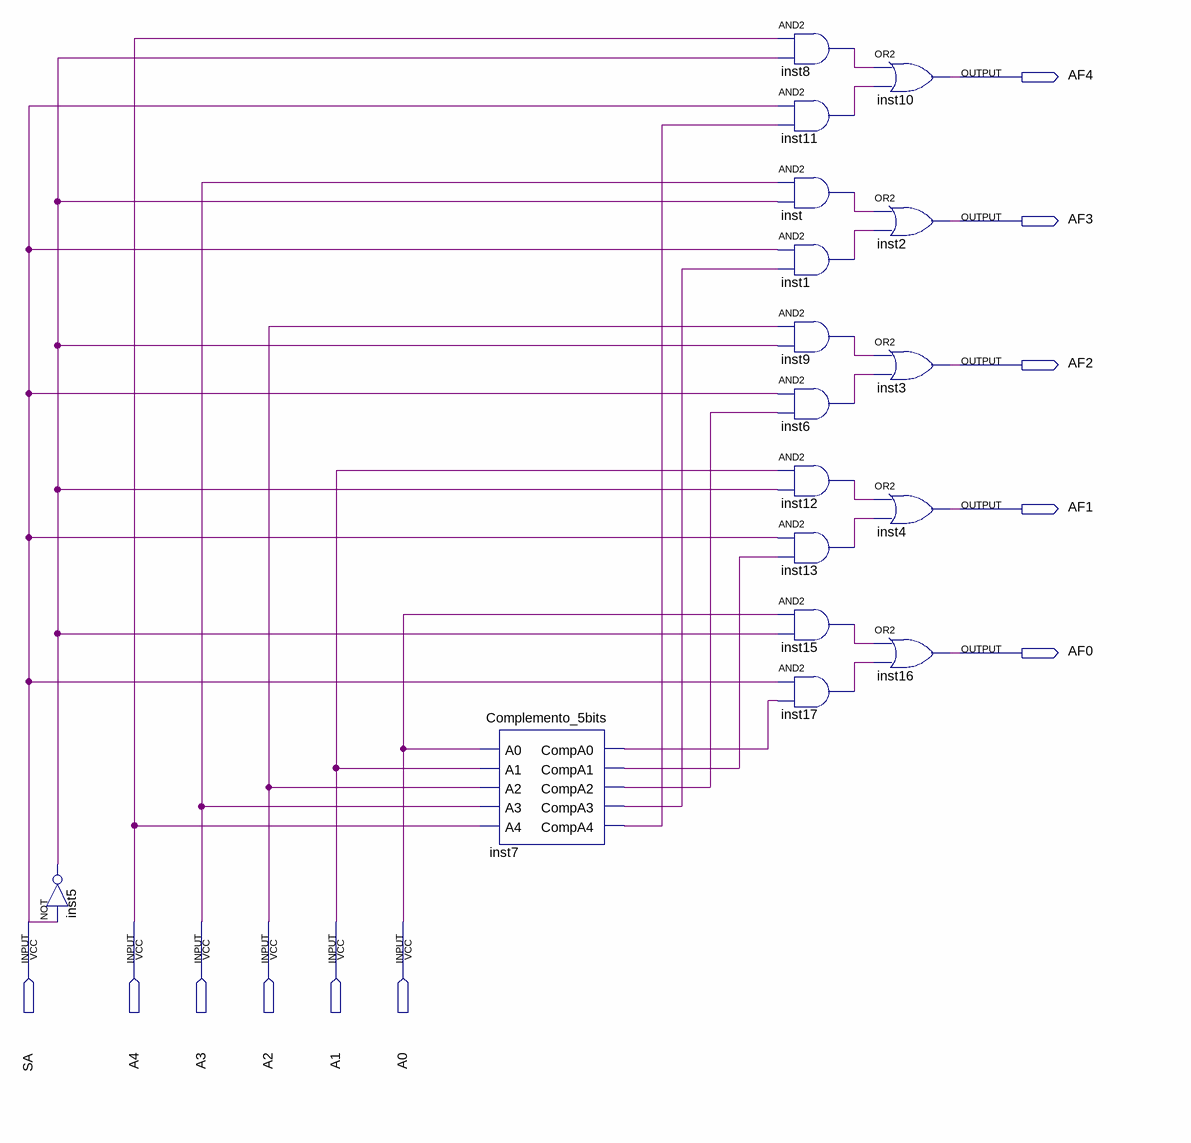
[diagram p0: schematic sheet]
// Quartus schematic DEC_SI_5bits.bdf as structural Verilog: 17 symbols, 11 pins
module DEC_SI_5bits (
  input  SA,
  input  A4,
  input  A3,
  input  A2,
  input  A1,
  input  A0,
  output AF4,
  output AF3,
  output AF2,
  output AF1,
  output AF0
);

  wire inst1_out, inst5_out, inst6_out, inst7_compa0, inst7_compa1, inst7_compa2, inst7_compa3, inst7_compa4,
       inst8_out, inst9_out, inst11_out, inst12_out, inst13_out, inst15_out, inst17_out, inst_out;

  not inst5 (inst5_out, SA);
  Complemento_5bits inst7 (
    .A0(A0), .A1(A1), .A2(A2), .A3(A3), .A4(A4), .CompA0(inst7_compa0), .CompA1(inst7_compa1),
    .CompA2(inst7_compa2), .CompA3(inst7_compa3), .CompA4(inst7_compa4));
  and inst8 (inst8_out, A4, inst5_out);
  and inst11 (inst11_out, SA, inst7_compa4);
  and inst (inst_out, A3, inst5_out);
  and inst1 (inst1_out, SA, inst7_compa3);
  and inst9 (inst9_out, A2, inst5_out);
  and inst6 (inst6_out, SA, inst7_compa2);
  and inst12 (inst12_out, A1, inst5_out);
  and inst13 (inst13_out, SA, inst7_compa1);
  and inst15 (inst15_out, A0, inst5_out);
  and inst17 (inst17_out, SA, inst7_compa0);
  or inst10 (AF4, inst8_out, inst11_out);
  or inst2 (AF3, inst_out, inst1_out);
  or inst3 (AF2, inst9_out, inst6_out);
  or inst4 (AF1, inst12_out, inst13_out);
  or inst16 (AF0, inst15_out, inst17_out);
endmodule
